# Altium schematic sheet LIN.SchDoc
size A4
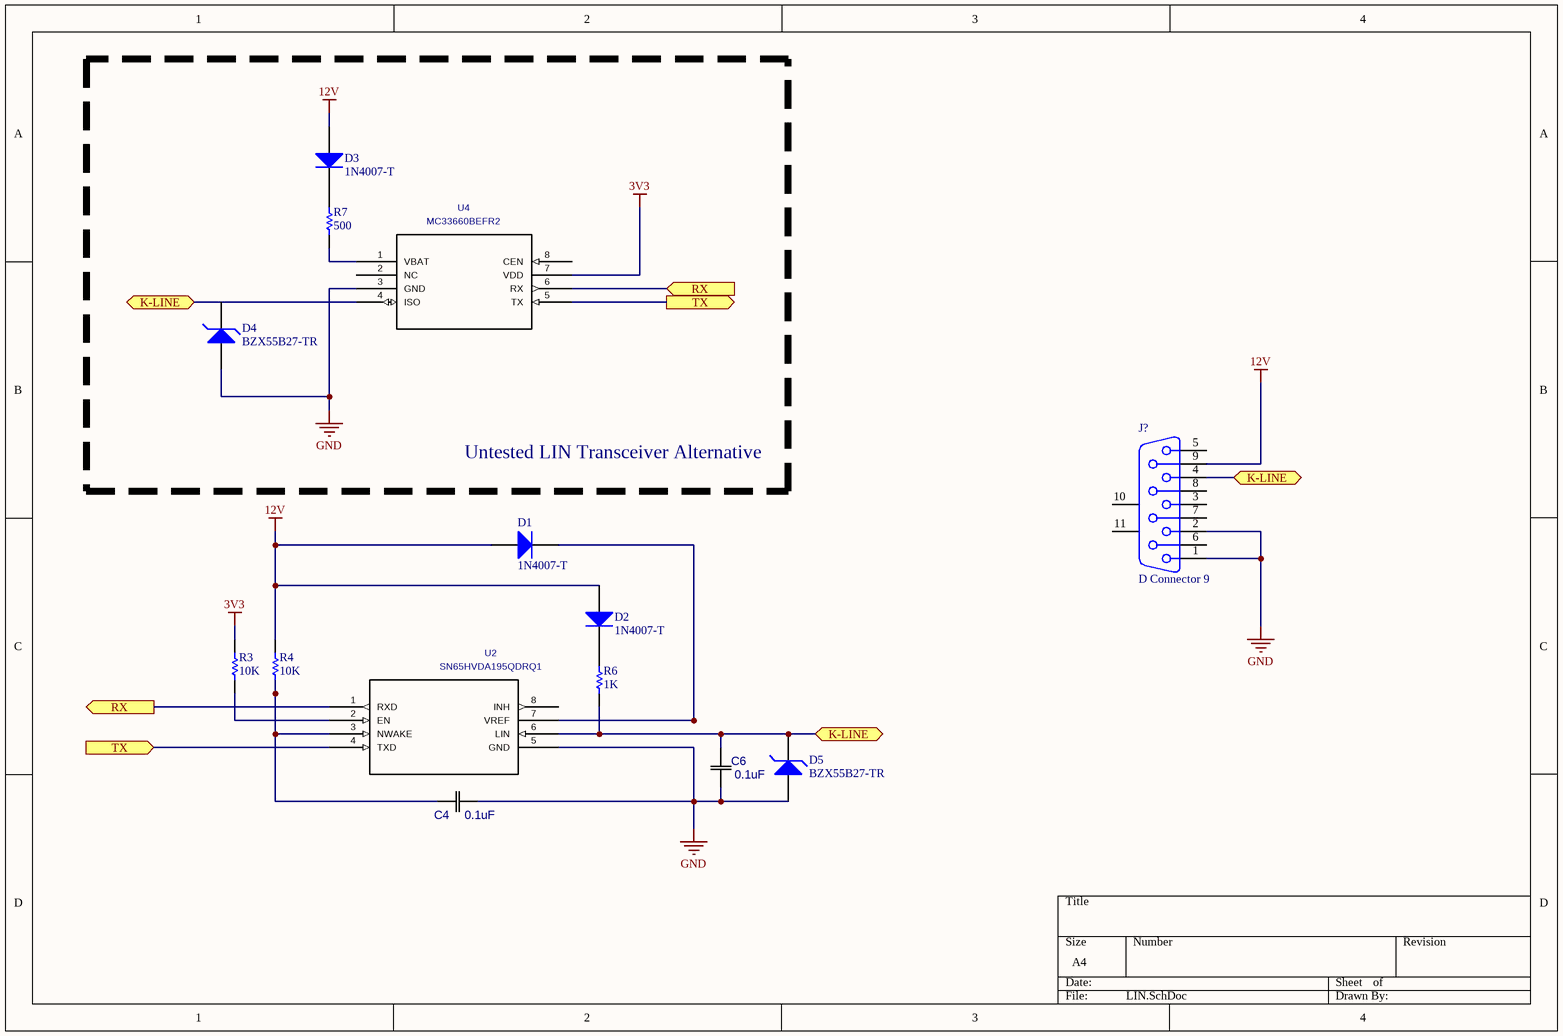
[diagram p0: LIN.SchDoc]

## Parts
C4  value 0.1uF  [CAP_TH_CER_5MM]  (hidden comment: CAP_TH_CER)
C6  value 0.1uF  [CAP_TH_CER_5MM]  (hidden comment: CAP_TH_CER)
D1  1N4007-T
D2  1N4007-T
D3  1N4007-T
D4  BZX55B27-TR
D5  BZX55B27-TR
J?  D Connector 9  [DSUB1.385-2H9]
R3  10K
R4  10K
R6  1K
R7  500
U2  SN65HVDA195QDRQ1  [8-Pin SOIC]
U4  MC33660BEFR2  [8-SOIC-3.90MM]

## Blocks framed on the sheet
Untested LIN Transceiver Alternative: D3 D4 R7 U4

## Ports
K-LINE, RX, TX

## Nets
3V3: R3.2 U4.7(VDD)
12V: D1.1(A) D2.1(A) D3.1(A) J?.9 R4.2
GND: C4.1 C6.1 D4.2(A) D5.2(A) J?.1 J?.2 U2.5(GND) U4.3(GND)
K-LINE: C6.2 D4.1(K) D5.1(K) J?.4 R6.1 U2.6(LIN) U4.4(ISO) ; port K-LINE
RX: U2.1(RXD) U4.6(RX) ; port RX
TX: U2.4(TXD) U4.5(TX) ; port TX
NetC4_2: C4.2 R4.1 U2.3(NWAKE)
NetD1_2: D1.2(K) U2.7(VREF)
NetD2_2: D2.2(K) R6.2
NetD3_2: D3.2(K) R7.2
NetR3_1: R3.1 U2.2(EN)
NetR7_1: R7.1 U4.1(VBAT)

Not connected (* = marked no-connect by the designer): J? 3 5 6 7 8 10(MH1) 11(MH2); U2 8(INH); U4 2(NC) 8(CEN)

## Library data of the parts
C4 C6 = CAP_TH_CER: Mfr_Name: TDK
D1-D3 = DIODE
D4 D5 = DIODE_ZENER: Zener Diode; MPN: ?
J? = D Connector 9: Receptacle Assembly, 9 Position, Right Angle; PackageDocument: O; Positions: 9; Published: 15-Jun-2001; LatestRevisionDate: 17-Jul-2002; LatestRevisionNote: Re-released for DXP Platform.; DatasheetDocument: 1-Sep-1999; PackageReference: 788750; Publisher: Altium Limited; Orientation: Right Angle; Gender: Receptacle
R3 R4 R6 R7 = RES: Resistor; Value: ? Ohms; MPN: ?; SuppliersPartNumber: ?; Power: ?
U2 = IC_LIN_SN65HVDA195QDRQ1: Mfr_Name: Texas Instruments; Value: SN65HVDA195QDRQ1; Manufacturer_Part_Number: SN65HVDA195QDRQ1
U4 = IC_LIN_MC33660BEFR2: Mfr_Name: NXP; Value: MC33660BEFR2; Manufacturer_Part_Number: MC33660BEFR2